# Altium schematic sheet Lesson3_SCH.SchDoc
size A4
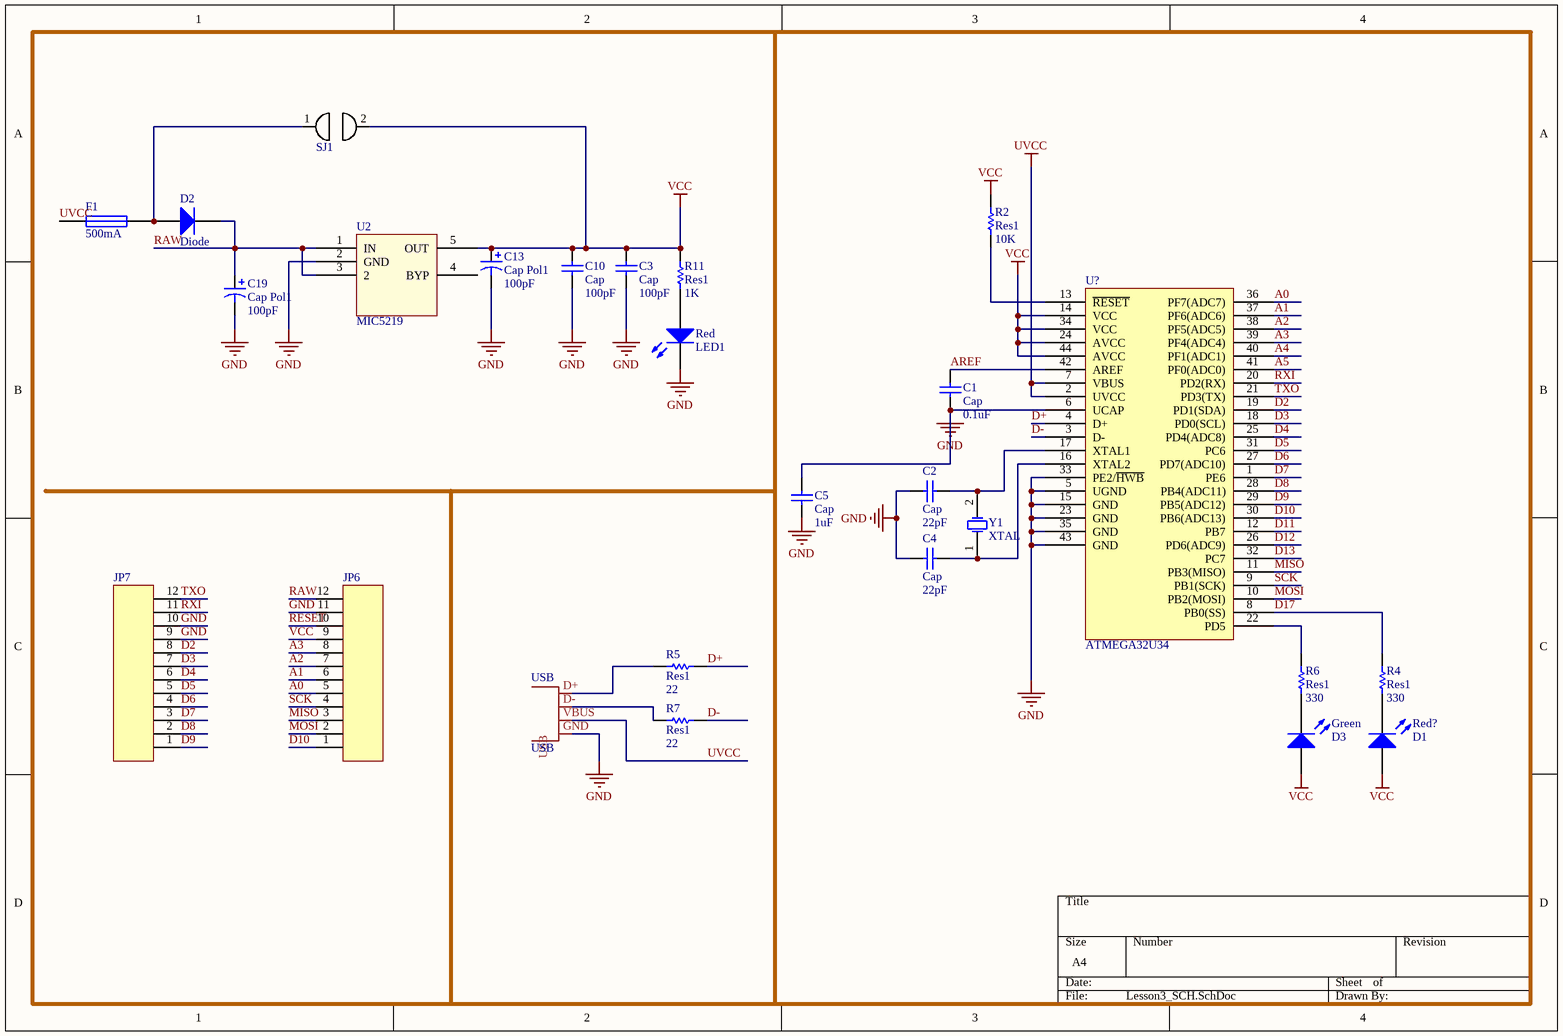
[diagram p0: Lesson3_SCH.SchDoc]

## Parts
?  SJ1
C1  Cap  value 0.1uF  [RAD-0.3]
C2  Cap  value 22pF  [RAD-0.3]
C3  Cap  value 100pF  [RAD-0.3]
C4  Cap  value 22pF  [RAD-0.3]
C5  Cap  value 1uF  [RAD-0.3]
C10  Cap  value 100pF  [RAD-0.3]
C13  Cap Pol1  value 100pF  [RB7.6-15]
C19  Cap Pol1  value 100pF  [RB7.6-15]
D2  Diode  [SMC]
F1  500mA  [PIN-W2/E2.8]
Green  D3  [LED-0]
JP6  (no value)
JP7  (no value)
R2  Res1  value 10K  [AXIAL-0.3]
R4  Res1  value 330  [AXIAL-0.3]
R5  Res1  value 22  [AXIAL-0.3]
R6  Res1  value 330  [AXIAL-0.3]
R7  Res1  value 22  [AXIAL-0.3]
R11  Res1  value 1K  [AXIAL-0.3]
Red  LED1  [LED-0]
Red?  D1  [LED-0]
U2  MIC5219
U?  ATMEGA32U34
USB  USB
Y1  XTAL  [R38]

## Nets
GND: C1.1 C2.1 C3.1 C4.1 C5.1 C5.2 C10.1 C13.2 C19.2 JP6.11 JP7.9 JP7.10 Red.2(K) U2.2(GND) U?.5(UGND) U?.6(UCAP) U?.15(GND) U?.23(GND) U?.33(PE2/~{HWB}) U?.35(GND) U?.43(GND) USB.GND
UVCC: F1.1 U?.2(UVCC) U?.7(VBUS) USB.VBUS
VCC: ?.2 C3.2 C10.2 C13.1 Green.1(A) JP6.9 R2.2 R11.2 Red?.1(A) U2.5(OUT) U?.14(VCC) U?.24(AVCC) U?.34(VCC) U?.44(AVCC)
A0: JP6.5 U?.36(PF7(ADC7))
A1: JP6.6 U?.37(PF6(ADC6))
A2: JP6.7 U?.38(PF5(ADC5))
A3: JP6.8 U?.39(PF4(ADC4))
A4: U?.40(PF1(ADC1))
A5: U?.41(PF0(ADC0))
AREF: C1.2 U?.42(AREF)
D2: JP7.8 U?.19(PD1(SDA))
D3: JP7.7 U?.18(PD0(SCL))
D4: JP7.6 U?.25(PD4(ADC8))
D5: JP7.5 U?.31(PC6)
D6: JP7.4 U?.27(PD7(ADC10))
D7: JP7.3 U?.1(PE6)
D8: JP7.2 U?.28(PB4(ADC11))
D9: JP7.1 U?.29(PB5(ADC12))
D10: JP6.1 U?.30(PB6(ADC13))
D11: U?.12(PB7)
D12: U?.26(PD6(ADC9))
D13: U?.32(PC7)
D17: R4.2 U?.8(PB0(SS))
D+: R5.2 U?.4(D+)
D-: R7.2 U?.3(D-)
MISO: JP6.3 U?.11(PB3(MISO))
MOSI: JP6.2 U?.10(PB2(MOSI))
RAW: C19.1 D2.2(K) JP6.12 U2.1(IN) U2.3(2)
RESET: JP6.10
RXI: JP7.11 U?.20(PD2(RX))
SCK: JP6.4 U?.9(PB1(SCK))
TXO: JP7.12 U?.21(PD3(TX))
Net?_1: ?.1 D2.1(A) F1.2
NetC2_2: C2.2 U?.17(XTAL1) Y1.2(OSC2)
NetC4_2: C4.2 U?.16(XTAL2) Y1.1(OSC1)
NetGreen_2: Green.2(K) R6.1
NetR2_1: R2.1 U?.13(~{RESET})
NetR4_1: R4.1 Red?.2(K)
NetR5_1: R5.1 USB.D+
NetR6_2: R6.2 U?.22(PD5)
NetR7_1: R7.1 USB.D-
NetR11_1: R11.1 Red.1(A)

Not connected (* = marked no-connect by the designer): U2 4(BYP)

## Library data of the parts
C1-C5 C10 = Cap: Capacitor; Published: 8-Jun-2000; LatestRevisionDate: 17-Jul-2002; LatestRevisionNote: Re-released for DXP Platform.; PackageReference: RAD-0.3; Publisher: Altium Limited; PackageDescription: Radial Cap, Thru-Hole; 2 Leads; 0.3 in Pin Spacing
C13 C19 = Cap Pol1: Polarized Capacitor (Radial); Published: 8-Jun-2000; LatestRevisionDate: 17-Jul-2002; LatestRevisionNote: Re-released for DXP Platform.; PackageReference: RB7.6-15; Publisher: Altium Limited; PackageDescription: Polarized Capacitor (Radial); 2 Leads
D2 = Diode: Default Diode; Published: 8-Jun-2000; LatestRevisionDate: 17-Jul-2002; LatestRevisionNote: Re-released for DXP Platform.; PackageVersion: Sep-1996; PackageReference: SMC; Publisher: Altium Limited; PackageDescription: DO-214-AB/SMC; 2 C-Bend Leads; Body 7.9 x 5.9 mm, inc. leads (LxW); Code_JEDEC: DO-214-AB
F1 = Fuse 1: Fuse; Published: 8-Jun-2000; LatestRevisionDate: 17-Jul-2002; LatestRevisionNote: Re-released for DXP Platform.; PackageReference: PIN-W2/E2.8; Publisher: Altium Limited; PackageDescription: Thru-Hole; 2 Leads
Green Red Red? = LED0: Typical INFRARED GaAs LED; Published: 8-Jun-2000; LatestRevisionDate: 08-Jul-2005; LatestRevisionNote: Mech Layer 1 removed.; PackageReference: LED-0; Publisher: Altium Limited; PackageDescription: LED; 2 Leads
JP6 JP7 = JP？
R2 R4-R7 R11 = Res1: Resistor; Published: 8-Jun-2000; LatestRevisionDate: 17-Jul-2002; LatestRevisionNote: Re-released for DXP Platform.; PackageReference: AXIAL-0.3; Publisher: Altium Limited; PackageDescription: Axial Device, Thru-Hole; 2 Leads; 0.3 in Pin Spacing
Y1 = XTAL: Crystal Oscillator; Published: 8-Jun-2000; LatestRevisionDate: 17-Jul-2002; LatestRevisionNote: Re-released for DXP Platform.; PackageReference: R38; Publisher: Altium Limited; PackageDescription: Crystal, Thru-Hole; 2 Leads; Body 3.1 x 8.2 mm (Dia.xH)